# Altium schematic sheet Sheet1.SchDoc
size A1
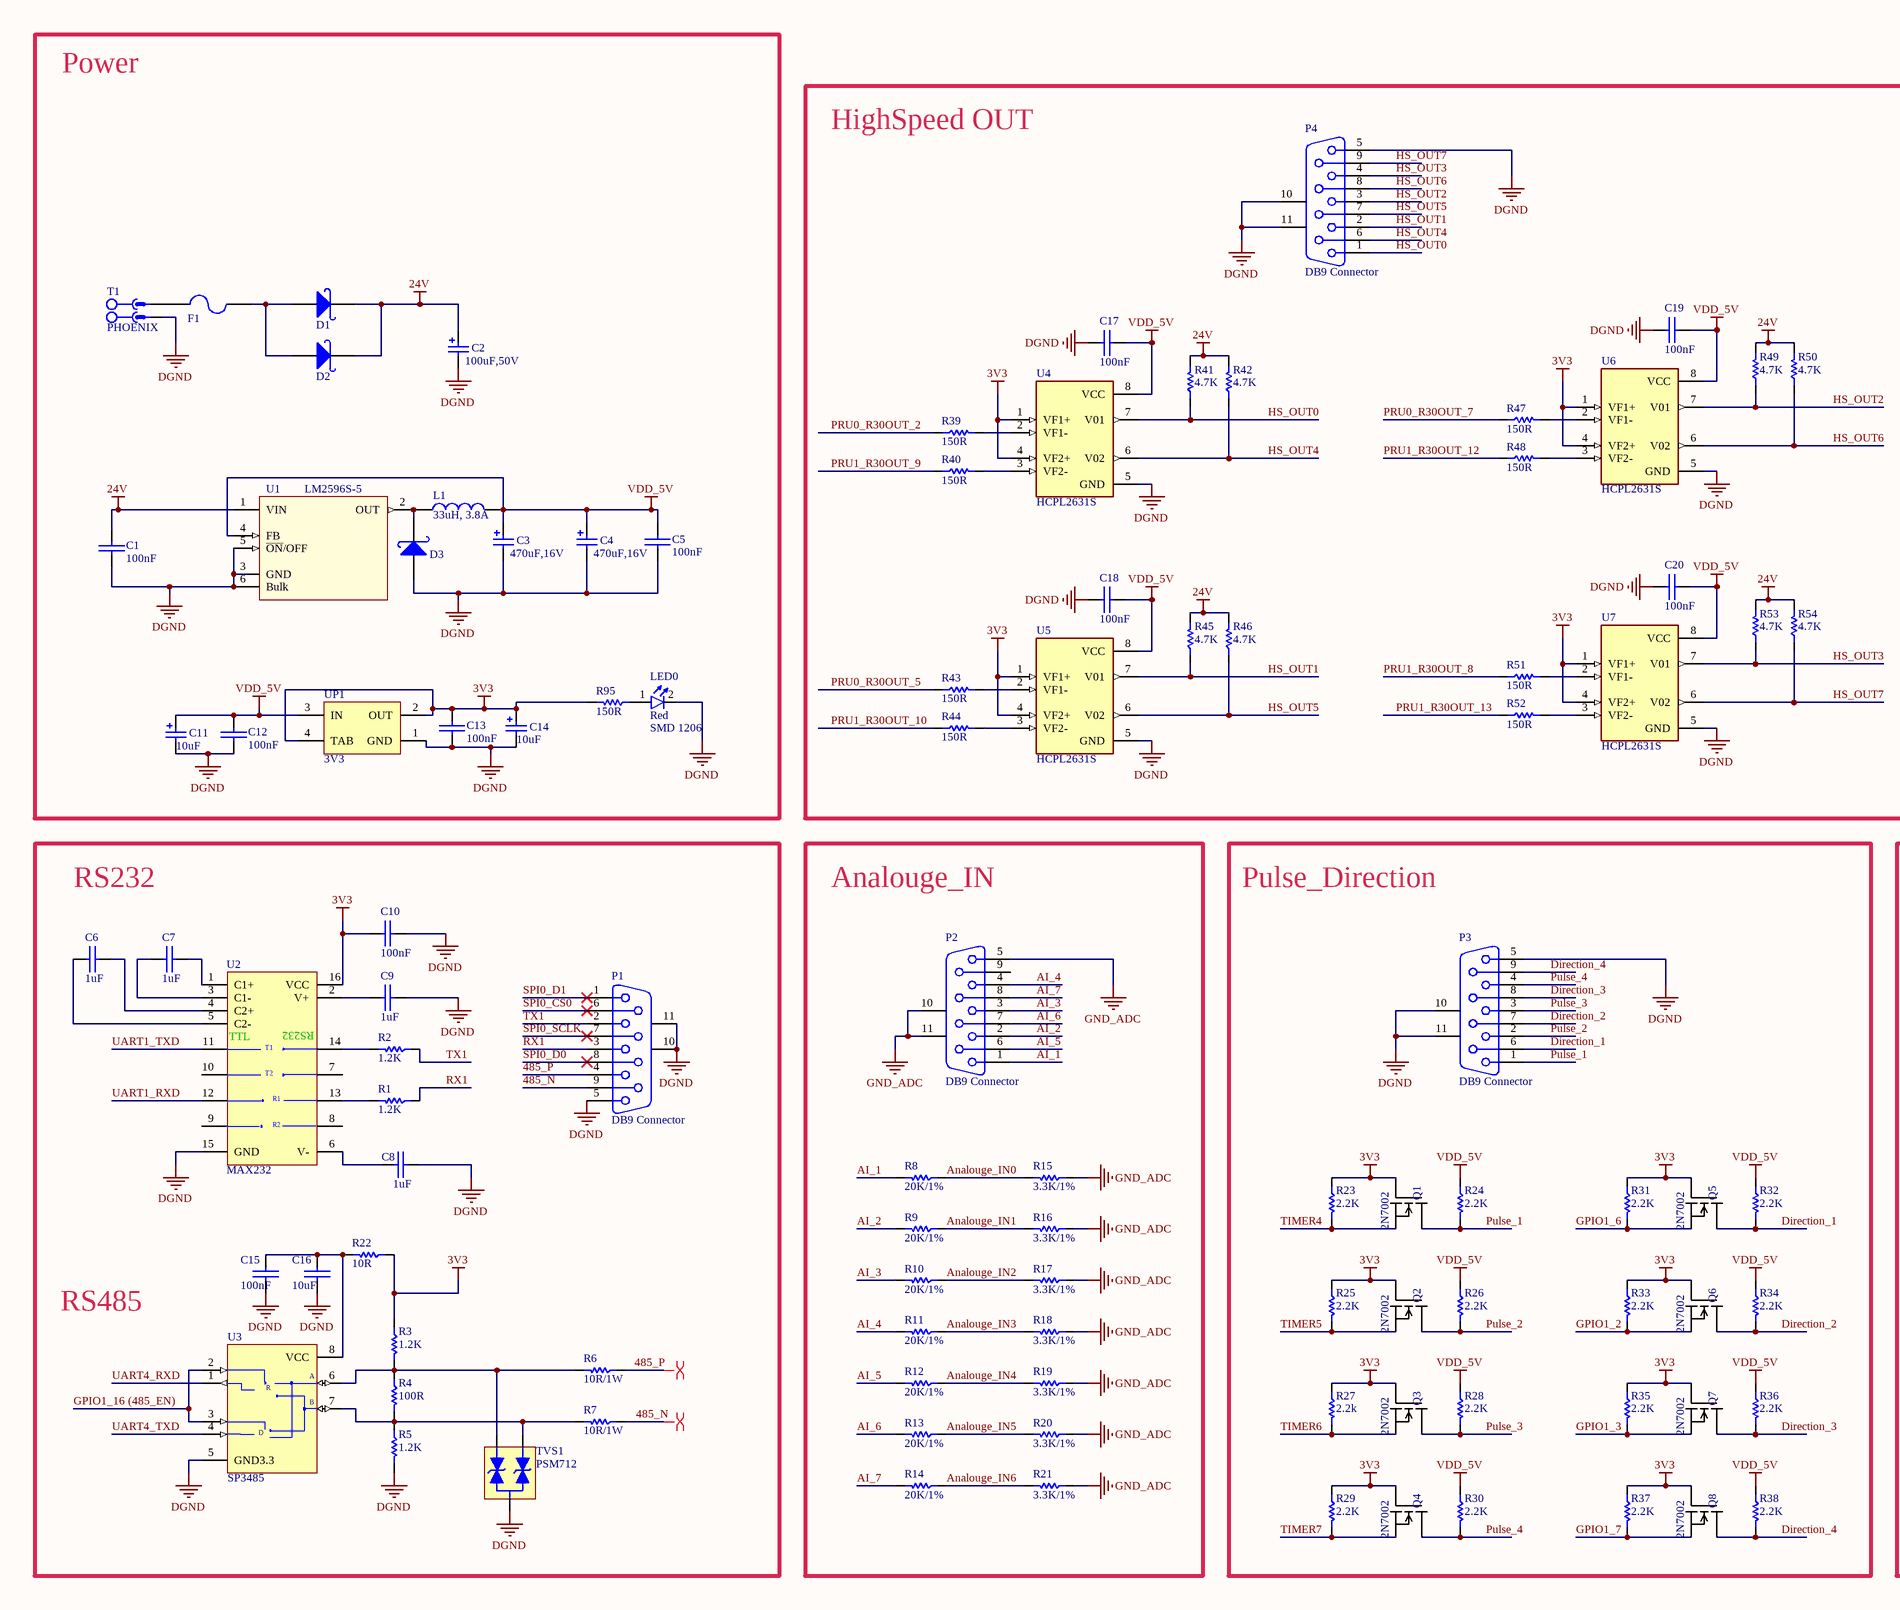
[diagram p0: Sheet1.SchDoc, left]
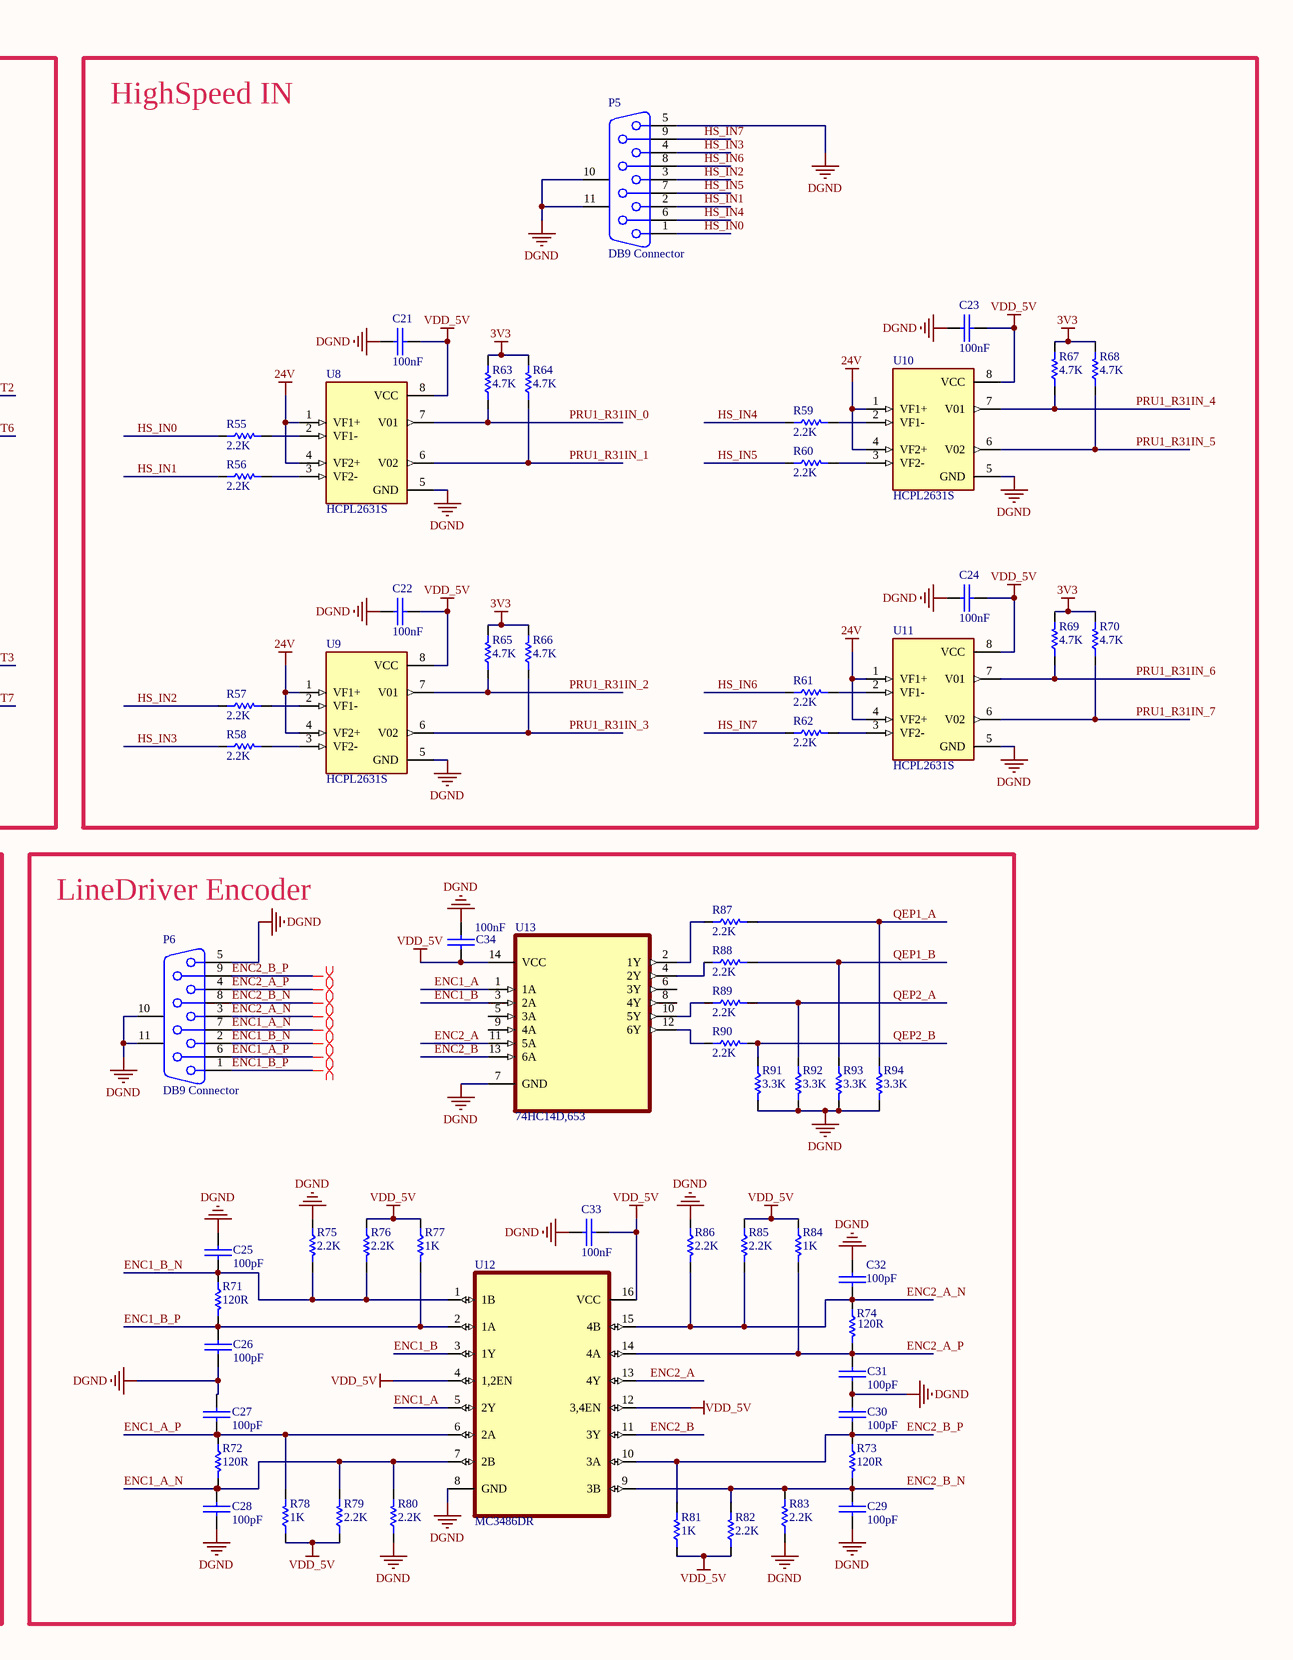
[diagram p1: Sheet1.SchDoc, right]

## Parts
C1  100nF  [SMD_CAP_0805]
C2  100uF,50V  [WCAP-AS5H_8x10.5]
C3  470uF,16V  [WCAP-AS5H_8x10.5]
C4  470uF,16V  [WCAP-AS5H_8x10.5]
C5  100nF  [SMD_CAP_0805]
C6  1uF  [SMD_CAP_0805]
C7  1uF  [SMD_CAP_0805]
C8  1uF  [SMD_CAP_0805]
C9  1uF  [SMD_CAP_0805]
C10  100nF  [SMD_CAP_0805]
C11  10uF  [WCAP-AS5H_4x5.5]
C12  100nF  [SMD_CAP_0805]
C13  100nF  [SMD_CAP_0805]
C14  10uF  [WCAP-AS5H_4x5.5]
C15  100nF  [SMD_CAP_0805]
C16  10uF  [SMD_CAP_0805]
C17  100nF  [SMD_CAP_0805]
C18  100nF  [SMD_CAP_0805]
C19  100nF  [SMD_CAP_0805]
C20  100nF  [SMD_CAP_0805]
C21  100nF  [SMD_CAP_0805]
C22  100nF  [SMD_CAP_0805]
C23  100nF  [SMD_CAP_0805]
C24  100nF  [SMD_CAP_0805]
C25  100pF  [SMD_CAP_0805]
C26  100pF  [SMD_CAP_0805]
C27  100pF  [SMD_CAP_0805]
C28  100pF  [SMD_CAP_0805]
C29  100pF  [SMD_CAP_0805]
C30  100pF  [SMD_CAP_0805]
C31  100pF  [SMD_CAP_0805]
C32  100pF  [SMD_CAP_0805]
C33  100nF  [SMD_CAP_0805]
C34  100nF  [SMD_CAP_0805]
D1  1n5822  [Diode 1N4007 SMD]  (value not drawn)
D2  1n5822  [Diode 1N4007 SMD]  (value not drawn)
D3  1n5822  [Diode 1N4007 SMD]  (value not drawn)
F1  F=1.0 A  [1206 FUSE]  (value not drawn)
L1  33uH, 3.8A  [WE-PD_1210]
LED0  Size: SMD 1206  [LED-3mm]  (hidden comment: Red)
P1  DB9 Connector  [DB9 Female]
P2  DB9 Connector  [DB9 Female]
P3  DB9 Connector  [DB9 Female]
P4  DB9 Connector  [DB9 Female]
P5  DB9 Connector  [DB9 Female]
P6  DB9 Connector  [DB9 Female]
Q1  2N7002  [*SOT23]
Q2  2N7002  [*SOT23]
Q3  2N7002  [*SOT23]
Q4  2N7002  [*SOT23]
Q5  2N7002  [*SOT23]
Q6  2N7002  [*SOT23]
Q7  2N7002  [*SOT23]
Q8  2N7002  [*SOT23]
R1  1.2K  [RES 0805 (2012X06L)]
R2  1.2K  [RES 0805 (2012X06L)]
R3  1.2K  [RES 0805 (2012X06L)]
R4  100R  [RES 1206 (3216X08L)]
R5  1.2K  [RES 0805 (2012X06L)]
R6  10R/1W  [RES 1206 (3216X08L)]
R7  10R/1W  [RES 1206 (3216X08L)]
R8  20K/1%  [RES 0805 (2012X06L)]
R9  20K/1%  [RES 0805 (2012X06L)]
R10  20K/1%  [RES 0805 (2012X06L)]
R11  20K/1%  [RES 0805 (2012X06L)]
R12  20K/1%  [RES 0805 (2012X06L)]
R13  20K/1%  [RES 0805 (2012X06L)]
R14  20K/1%  [RES 0805 (2012X06L)]
R15  3.3K/1%  [RES 0805 (2012X06L)]
R16  3.3K/1%  [RES 0805 (2012X06L)]
R17  3.3K/1%  [RES 0805 (2012X06L)]
R18  3.3K/1%  [RES 0805 (2012X06L)]
R19  3.3K/1%  [RES 0805 (2012X06L)]
R20  3.3K/1%  [RES 0805 (2012X06L)]
R21  3.3K/1%  [RES 0805 (2012X06L)]
R22  10R  [RES 0805 (2012X06L)]
R23  2.2K  [RES 0805 (2012X06L)]
R24  2.2K  [RES 0805 (2012X06L)]
R25  2.2K  [RES 0805 (2012X06L)]
R26  2.2K  [RES 0805 (2012X06L)]
R27  2.2k  [RES 0805 (2012X06L)]
R28  2.2K  [RES 0805 (2012X06L)]
R29  2.2K  [RES 0805 (2012X06L)]
R30  2.2K  [RES 0805 (2012X06L)]
R31  2.2K  [RES 0805 (2012X06L)]
R32  2.2K  [RES 0805 (2012X06L)]
R33  2.2K  [RES 0805 (2012X06L)]
R34  2.2K  [RES 0805 (2012X06L)]
R35  2.2K  [RES 0805 (2012X06L)]
R36  2.2K  [RES 0805 (2012X06L)]
R37  2.2K  [RES 0805 (2012X06L)]
R38  2.2K  [RES 0805 (2012X06L)]
R39  150R  [RES 0805 (2012X06L)]
R40  150R  [RES 0805 (2012X06L)]
R41  4.7K  [RES 0805 (2012X06L)]
R42  4.7K  [RES 0805 (2012X06L)]
R43  150R  [RES 0805 (2012X06L)]
R44  150R  [RES 0805 (2012X06L)]
R45  4.7K  [RES 0805 (2012X06L)]
R46  4.7K  [RES 0805 (2012X06L)]
R47  150R  [RES 0805 (2012X06L)]
R48  150R  [RES 0805 (2012X06L)]
R49  4.7K  [RES 0805 (2012X06L)]
R50  4.7K  [RES 0805 (2012X06L)]
R51  150R  [RES 0805 (2012X06L)]
R52  150R  [RES 0805 (2012X06L)]
R53  4.7K  [RES 0805 (2012X06L)]
R54  4.7K  [RES 0805 (2012X06L)]
R55  2.2K  [RES 0805 (2012X06L)]
R56  2.2K  [RES 0805 (2012X06L)]
R57  2.2K  [RES 0805 (2012X06L)]
R58  2.2K  [RES 0805 (2012X06L)]
R59  2.2K  [RES 0805 (2012X06L)]
R60  2.2K  [RES 0805 (2012X06L)]
R61  2.2K  [RES 0805 (2012X06L)]
R62  2.2K  [RES 0805 (2012X06L)]
R63  4.7K  [RES 0805 (2012X06L)]
R64  4.7K  [RES 0805 (2012X06L)]
R65  4.7K  [RES 0805 (2012X06L)]
R66  4.7K  [RES 0805 (2012X06L)]
R67  4.7K  [RES 0805 (2012X06L)]
R68  4.7K  [RES 0805 (2012X06L)]
R69  4.7K  [RES 0805 (2012X06L)]
R70  4.7K  [RES 0805 (2012X06L)]
R71  120R  [RES 0805 (2012X06L)]
R72  120R  [RES 0805 (2012X06L)]
R73  120R  [RES 0805 (2012X06L)]
R74  120R  [RES 0805 (2012X06L)]
R75  2.2K  [RES 0805 (2012X06L)]
R76  2.2K  [RES 0805 (2012X06L)]
R77  1K  [RES 0805 (2012X06L)]
R78  1K  [RES 0805 (2012X06L)]
R79  2.2K  [RES 0805 (2012X06L)]
R80  2.2K  [RES 0805 (2012X06L)]
R81  1K  [RES 0805 (2012X06L)]
R82  2.2K  [RES 0805 (2012X06L)]
R83  2.2K  [RES 0805 (2012X06L)]
R84  1K  [RES 0805 (2012X06L)]
R85  2.2K  [RES 0805 (2012X06L)]
R86  2.2K  [RES 0805 (2012X06L)]
R87  2.2K  [RES 0805 (2012X06L)]
R88  2.2K  [RES 0805 (2012X06L)]
R89  2.2K  [RES 0805 (2012X06L)]
R90  2.2K  [RES 0805 (2012X06L)]
R91  3.3K  [RES 0805 (2012X06L)]
R92  3.3K  [RES 0805 (2012X06L)]
R93  3.3K  [RES 0805 (2012X06L)]
R94  3.3K  [RES 0805 (2012X06L)]
R95  150R  [RES 0805 (2012X06L)]
T1  PHOENIX  [MSTB 2,5/2-G-5,08]
TVS1  PSM712  [SOT23_BEC_N]
U1  LM2596S-5  [*TO170P1435X465-6N]
U2  MAX232  [NSO16_M]
U3  SP3485  [*SO08]
U4  HCPL2631S  [OPTO_HCPL2631S]
U5  HCPL2631S  [OPTO_HCPL2631S]
U6  HCPL2631S  [OPTO_HCPL2631S]
U7  HCPL2631S  [OPTO_HCPL2631S]
U8  HCPL2631S  [OPTO_HCPL2631S]
U9  HCPL2631S  [OPTO_HCPL2631S]
U10  HCPL2631S  [OPTO_HCPL2631S]
U11  HCPL2631S  [OPTO_HCPL2631S]
U12  MC3486DR  [SOIC127P600X175-16N]
U13  74HC14D,653  [SOIC127P600X175-14N]
UP1  3V3  [SOT223]

## Blocks framed on the sheet
Power: C1-C5 C11-C14 D1-D3 F1 L1 LED0 R95 T1 U1 UP1
HighSpeed OUT: C17-C20 P4 R39-R54 U4-U7
HighSpeed IN: C21-C24 P5 R55-R70 U8-U11
Analouge_IN: P2 R8-R21
Pulse_Direction: P3 Q1-Q8 R23-R38
LineDriver Encoder: C25-C34 P6 R71-R94 U12 U13

## Nets
3V3: C10.2(-) C13.1(+) C14.2(P) Q1.1(G) Q2.1(G) Q3.1(G) Q4.1(G) Q5.1(G) Q6.1(G) Q7.1(G) Q8.1(G) R3.1 R22.1 R23.1 R25.1 R27.1 R29.1 R31.1 R33.1 R35.1 R37.1 R63.2 R64.2 R65.2 R66.2 R67.2 R68.2 R69.2 R70.2 R95.2 U2.16(VCC) U4.1(VF1+) U4.4(VF2+) U5.1(VF1+) U5.4(VF2+) U6.1(VF1+) U6.4(VF2+) U7.1(VF1+) U7.4(VF2+) UP1.2(OUT) UP1.4(TAB)
24V: C1.1(+) C2.2(P) D1.2(K) D2.2(K) R41.2 R42.2 R45.2 R46.2 R49.2 R50.2 R53.2 R54.2 U1.1(VIN) U8.1(VF1+) U8.4(VF2+) U9.1(VF1+) U9.4(VF2+) U10.1(VF1+) U10.4(VF2+) U11.1(VF1+) U11.4(VF2+)
DGND: C1.2(-) C2.1(N) C3.1(N) C4.1(N) C5.2(-) C8.2(-) C9.2(-) C10.1(+) C11.1(N) C12.2(-) C13.2(-) C14.1(N) C15.1(+) C16.1(+) C17.1(+) C18.1(+) C19.1(+) C20.1(+) C21.1(+) C22.1(+) C23.1(+) C24.1(+) C25.2(-) C26.1(+) C27.2(-) C28.1(+) C29.1(+) C30.2(-) C31.1(+) C32.2(-) C33.1(+) C34.1(+) D3.1(A) LED0.2(K) P1.5 P1.10(MH1) P1.11(MH2) P3.5 P3.10(MH1) P3.11(MH2) P4.5 P4.10(MH1) P4.11(MH2) P5.5 P5.10(MH1) P5.11(MH2) P6.5 P6.10(MH1) P6.11(MH2) R5.2 R75.1 R80.1 R83.1 R86.1 R91.2 R92.2 R93.2 R94.2 T1.1 TVS1.3(K) U1.3(GND) U1.5(~{ON}/OFF) U1.6(Bulk) U2.15(GND) U3.5(GND3.3) U4.5(GND) U5.5(GND) U6.5(GND) U7.5(GND) U8.5(GND) U9.5(GND) U10.5(GND) U11.5(GND) U12.8(GND) U13.7(GND) UP1.1(GND)
GND_ADC: P2.5 P2.10(MH1) P2.11(MH2) R15.1 R16.1 R17.1 R18.1 R19.1 R20.1 R21.1
VDD_5V: C3.2(P) C4.2(P) C5.1(+) C11.2(P) C12.1(+) C17.2(-) C18.2(-) C19.2(-) C20.2(-) C21.2(-) C22.2(-) C23.2(-) C24.2(-) C33.2(-) C34.2(-) L1.2 R24.1 R26.1 R28.1 R30.1 R32.1 R34.1 R36.1 R38.1 R76.1 R77.1 R78.1 R79.1 R81.1 R82.1 R84.1 R85.1 U1.4(FB) U4.8(VCC) U5.8(VCC) U6.8(VCC) U7.8(VCC) U8.8(VCC) U9.8(VCC) U10.8(VCC) U11.8(VCC) U12.4(1,2EN) U12.12(3,4EN) U12.16(VCC) U13.14(VCC) UP1.3(IN)
485_N: P1.9 R7.1
485_P: P1.4 R6.1
AI_1: P2.1 R8.2
AI_2: P2.2 R9.2
AI_3: P2.3 R10.2
AI_4: P2.4 R11.2
AI_5: P2.6 R12.2
AI_6: P2.7 R13.2
AI_7: P2.8 R14.2
Analouge_IN0: R8.1 R15.2
Analouge_IN1: R9.1 R16.2
Analouge_IN2: R10.1 R17.2
Analouge_IN3: R11.1 R18.2
Analouge_IN4: R12.1 R19.2
Analouge_IN5: R13.1 R20.2
Analouge_IN6: R14.1 R21.2
Direction_1: P3.6 Q5.3(D) R32.2
Direction_2: P3.7 Q6.3(D) R34.2
Direction_3: P3.8 Q7.3(D) R36.2
Direction_4: P3.9 Q8.3(D) R38.2
ENC1_A: U12.5(2Y) U13.1(1A)
ENC1_A_N: C28.2(-) P6.7 R72.2 R79.2 R80.2 U12.7(2B)
ENC1_A_P: C27.1(+) P6.6 R72.1 R78.2 U12.6(2A)
ENC1_B: U12.3(1Y) U13.3(2A)
ENC1_B_N: C25.1(+) P6.2 R71.1 R75.2 R76.2 U12.1(1B)
ENC1_B_P: C26.2(-) P6.1 R71.2 R77.2 U12.2(1A)
ENC2_A: U12.13(4Y) U13.11(5A)
ENC2_A_N: C32.1(+) P6.3 R74.1 R85.2 R86.2 U12.15(4B)
ENC2_A_P: C31.2(-) P6.4 R74.2 R84.2 U12.14(4A)
ENC2_B: U12.11(3Y) U13.13(6A)
ENC2_B_N: C29.2(-) P6.8 R73.2 R82.2 R83.2 U12.9(3B)
ENC2_B_P: C30.1(+) P6.9 R73.1 R81.2 U12.10(3A)
GPIO1_2: Q6.2(S) R33.2
GPIO1_3: Q7.2(S) R35.2
GPIO1_6: Q5.2(S) R31.2
GPIO1_7: Q8.2(S) R37.2
GPIO1_16 (485_EN): U3.2(~{RE}) U3.3(DE)
HS_IN0: P5.1 R55.1
HS_IN1: P5.2 R56.1
HS_IN2: P5.3 R57.1
HS_IN3: P5.4 R58.1
HS_IN4: P5.6 R59.1
HS_IN5: P5.7 R60.1
HS_IN6: P5.8 R61.1
HS_IN7: P5.9 R62.1
HS_OUT0: P4.1 R41.1 U4.7(V01)
HS_OUT1: P4.2 R45.1 U5.7(V01)
HS_OUT2: P4.3 R49.1 U6.7(V01)
HS_OUT3: P4.4 R53.1 U7.7(V01)
HS_OUT4: P4.6 R42.1 U4.6(V02)
HS_OUT5: P4.7 R46.1 U5.6(V02)
HS_OUT6: P4.8 R50.1 U6.6(V02)
HS_OUT7: P4.9 R54.1 U7.6(V02)
PRU0_R30OUT_2: R39.1
PRU0_R30OUT_5: R43.1
PRU0_R30OUT_7: R47.1
PRU1_R30OUT_8: R51.1
PRU1_R30OUT_9: R40.1
PRU1_R30OUT_10: R44.1
PRU1_R30OUT_12: R48.1
PRU1_R30OUT_13: R52.1
PRU1_R31IN_0: R63.1 U8.7(V01)
PRU1_R31IN_1: R64.1 U8.6(V02)
PRU1_R31IN_2: R65.1 U9.7(V01)
PRU1_R31IN_3: R66.1 U9.6(V02)
PRU1_R31IN_4: R67.1 U10.7(V01)
PRU1_R31IN_5: R68.1 U10.6(V02)
PRU1_R31IN_6: R69.1 U11.7(V01)
PRU1_R31IN_7: R70.1 U11.6(V02)
Pulse_1: P3.1 Q1.3(D) R24.2
Pulse_2: P3.2 Q2.3(D) R26.2
Pulse_3: P3.3 Q3.3(D) R28.2
Pulse_4: P3.4 Q4.3(D) R30.2
QEP1_A: R87.2 R94.1
QEP1_B: R88.2 R93.1
QEP2_A: R89.2 R92.1
QEP2_B: R90.2 R91.1
RX1: P1.3 R1.1
SPI0_CS0: P1.6
SPI0_D0: P1.8
SPI0_D1: P1.1
SPI0_SCLK: P1.7
TIMER4: Q1.2(S) R23.2
TIMER5: Q2.2(S) R25.2
TIMER6: Q3.2(S) R27.2
TIMER7: Q4.2(S) R29.2
TX1: P1.2 R2.1
UART1_RXD: U2.12(R1OUT)
UART1_TXD: U2.11(T1IN)
UART4_RXD: U3.1(RO)
UART4_TXD: U3.4(DI)
NetC6_1: C6.1(+) U2.5(C2-)
NetC6_2: C6.2(-) U2.4(C2+)
NetC7_1: C7.1(+) U2.3(C1-)
NetC7_2: C7.2(-) U2.1(C1+)
NetC8_1: C8.1(+) U2.6(V-)
NetC9_1: C9.1(+) U2.2(V+)
NetC15_2: C15.2(-) C16.2(-) R22.2 U3.8(VCC)
NetD1_1: D1.1(A) D2.1(A) F1.1
NetD3_2: D3.2(K) L1.1 U1.2(OUT)
NetF1_2: F1.2 T1.2
NetLED0_1: LED0.1(A) R95.1
NetR1_2: R1.2 U2.13(R1IN)
NetR2_2: R2.2 U2.14(T1OUT)
NetR3_2: R3.2 R4.1 R6.2 TVS1.2(A) U3.6(A)
NetR4_2: R4.2 R5.1 R7.2 TVS1.1(A) U3.7(B)
NetR39_2: R39.2 U4.2(VF1-)
NetR40_2: R40.2 U4.3(VF2-)
NetR43_2: R43.2 U5.2(VF1-)
NetR44_2: R44.2 U5.3(VF2-)
NetR47_2: R47.2 U6.2(VF1-)
NetR48_2: R48.2 U6.3(VF2-)
NetR51_2: R51.2 U7.2(VF1-)
NetR52_2: R52.2 U7.3(VF2-)
NetR55_2: R55.2 U8.2(VF1-)
NetR56_2: R56.2 U8.3(VF2-)
NetR57_2: R57.2 U9.2(VF1-)
NetR58_2: R58.2 U9.3(VF2-)
NetR59_2: R59.2 U10.2(VF1-)
NetR60_2: R60.2 U10.3(VF2-)
NetR61_2: R61.2 U11.2(VF1-)
NetR62_2: R62.2 U11.3(VF2-)
NetR87_1: R87.1 U13.2(1Y)
NetR88_1: R88.1 U13.4(2Y)
NetR89_1: R89.1 U13.10(5Y)
NetR90_1: R90.1 U13.12(6Y)

Not connected (* = marked no-connect by the designer): P2 9; U2 7(T2OUT) 8(R2IN) 9(R2OUT) 10(T2IN); U13 5(3A) 6(3Y) 8(4Y) 9(4A)

## Layout directives
differential pair: 485_N, 485_P, ENC1_A_N, ENC1_A_P, ENC1_B_N, ENC1_B_P, ENC2_A_N, ENC2_A_P, ENC2_B_N, ENC2_B_P

## Notes on the sheet
- RS232
- RS485
- (in symbol MAX232) TTL; RS232; T1; T2; R1; R2
- (in symbol MAX485CPA) R; D

## Library data of the parts
C1 C5-C10 C12 C13 C15-C34 = Cap-Bipolar: Bipolar Capacitor; Voltage: 100V; Designer: Saeid Jorablo; Organazation: ControTec; Adding Date: 1387/12/20
  C1 C5 C10 C12 C13 C15 C17-C24 C33 C34: Value: 100nF
  C6-C9: Value: 1uF
  C16: Value: 10uF
  C25-C32: Value: 100pF
C2-C4 = 865230653012: WCAP-AS5H SMT Aluminum Electrolytic Capacitors, D8mm x L10.5mm, 47uF, +/-20%, 50VDC; Dissipation Factor: 12%; Endurance: 5000h; Leakage Current: 23.5uA; Ripple Current max.: 95mA; Technical Reference: ASDE105470M050DVCTEE000; ComponentLink1Description: Manufacturer; ComponentLink1URL: http://www.we-online.de; ComponentLink2Description: Datasheet; ComponentLink2URL: https://katalog.we-online.com/pbs/datasheet/865230653012.pdf; Length: 10.5mm; Mounting Technology: SMT; Operating Temperature: -40 to +105degC; Packaging: Tape and Reel; Published Date: August 2019; Capacitance: 47uF; Diameter: 8mm; Part Number: 865230653012; Publisher: Wurth Elektronik; Capacitance Tolerance: +/-20%; Rated Voltage: 50VDC
C11 C14 = 865230140001: WCAP-AS5H SMT Aluminum Electrolytic Capacitors, D4mm x L5.5mm, 22uF, +/-20%, 6.3VDC; Dissipation Factor: 32%; Endurance: 5000h; Leakage Current: 3uA; Ripple Current max.: 22mA; Technical Reference: ASDB055220M6R3DVCTAE000; ComponentLink1Description: Manufacturer; ComponentLink1URL: http://www.we-online.de; ComponentLink2Description: Datasheet; ComponentLink2URL: https://katalog.we-online.com/pbs/datasheet/865230140001.pdf; Length: 5.5mm; Mounting Technology: SMT; Operating Temperature: -40 to +105degC; Packaging: Tape and Reel; Published Date: August 2019; Capacitance: 22uF; Diameter: 4mm; Part Number: 865230140001; Publisher: Wurth Elektronik; Capacitance Tolerance: +/-20%; Rated Voltage: 6.3VDC
D1-D3 = 1N5822 SMD: Schottky Rectifiers; Part. No: SS34; Manufacturer: ON Semiconductor/Fairchild; Designer: Abbas Basereh; Link: https://www.aliexpress.com/item/Free-shipping-100pcs-1n5822-sma-smd-do-214ac-Schottky-diode-ss34/32337482329.html?spm=2114.01010208.3.1.zLZDsP&ws_ab_test=searchweb0_0,searchweb201602_4_10065_10068_10084_10083_10080_10082_10081_10060_10061_10062_10056_10055_10054_10059_10099_10078_10079_427_10073_10103_10102_10096_10052_10050_10051,searchweb201603_4&btsid=6e50dc92-ac69-45bc-a19e-209af19ce602; Link: http://www.tme.eu/en/details/ss34/smd-schottky-diodes/vishay/ss34-e357t/; Link: http://www.digikey.com/product-detail/en/on-semiconductor-fairchild/SS34/SS34FSCT-ND/2094459; Data: 16-12-2016
F1 = Fuse SMD1206: SMD Fuses 1206; Designer: Abbas Basereh; Desc.: SMD Fuses 1206; Data: 16-12-2016
L1 = 7447709470: WE-PD SMT Power Inductor, size 1210, 47uH, 3.8A; DC Resistance max.: 60mOhm; Self Resonant Frequency: 6.5MHz; Saturation Current: 4.5A; ComponentLink1Description: Manufacturer; ComponentLink1URL: http://www.we-online.de; ComponentLink2Description: Datasheet; ComponentLink2URL: https://katalog.we-online.com/pbs/datasheet/7447709470.pdf; Part Number: 7447709470; Published Date: April 2019; Publisher: Wurth Elektronik; Rated Current: 3.8A; Size: 1210; Inductance: 47uH; Operating Temperature: -40 to +125degC; Mounting Technology: SMT; Packaging: Tape and Reel; Value: 33uH, 3.8A
LED0 = LED: Designer: Saeid Jorablo; Organazation: ControTec; Adding Date: 1387/12/22; Color: Red
P1-P6 = DB9 Connector: Receptacle Assembly, 9 Position, Right Angle; PackageDocument: O; Positions: 9; Published: 15-Jun-2001; LatestRevisionDate: 17-Jul-2002; LatestRevisionNote: Re-released for DXP Platform.; DatasheetDocument: 1-Sep-1999; PackageReference: 788750; Publisher: Altium Limited; Orientation: Right Angle; Gender: Receptacle
Q1-Q8 = 2N7002: Transistor NPN Mos 2N7002 SILICONIX miliampere=100 V=60 SOt23; MF: STMicroelectronics; Availability: Unavailable; SnapEDA_Link: https://www.snapeda.com/parts/2N7002/STMicroelectronics/view-part/?ref=snap; Price: None; Package: SOT-23-3 Vishay; MP: 2N7002; Value: *
R1-R95 = Resistor: Tolerance: 5%; Power: 1/8 W
  R1-R3 R5: Value: 1.2K
  R4: Value: 100R
  R6 R7: Value: 10R/1W
  R8-R14: Value: 20K/1%
  R15-R21: Value: 3.3K/1%
  R22: Value: 10R
  R23-R26 R28-R38 R55-R62 R75 R76 R79 R80 R82 R83 R85-R90: Value: 2.2K
  R27: Value: 2.2k
  R39 R40 R43 R44 R47 R48 R51 R52 R95: Value: 150R
  R41 R42 R45 R46 R49 R50 R53 R54 R63-R70: Value: 4.7K
  R71-R74: Value: 120R
  R77 R78 R81 R84: Value: 1K
  R91-R94: Value: 3.3K
T1 = CON_Phoenix_MSTB_02: 2 Pitch: 5.08 mm Color: green Contact surface: Tin Assembly; Manufacturer: PHOENIX CONTACT; Connector type: PCB Terminal Block; designer: ABBAS BASEREH; Max Current: 12 A; Positions: 2; Voltage: 320 V; Category: Connector; ComponentLink1Description: Header, Nominal current: 12 A Rated voltage (III/2): 320 V Number of positions: 2 Pitch: 5.08 mm Color: green Contact surface: Tin Assembly: Soldering  DESIGNER:ABBAS BASEREH; ComponentLink2Description: Reference; Mounting Technology: Through-Hole; Pin Count: 2; Revision 1: 2017-3-1; Status: Unreleased; PART.NO: PHOENIX
U1 = LM2596S-3.3: MF: Texas Instruments; SnapEDA_Link: https://www.snapeda.com/parts/LM2596S-3.3/Texas%20Instruments/view-part/?ref=snap; Availability: Unavailable; MP: LM2596S-5; Price: None; Package: TO-263-6 HTC Korea; Value: *
U2 = MAX232: +5V Powered, Multi-Channel RS-232 Driver/Receiver; ComponentAuthor: Saeid Jorablo; ComponentLink1Description: Datasheet; ComponentLink1URL: http://pdfserv.maxim-ic.com/en/ds/MAX220-MAX249.pdf
U3 = MAX485CPA: Low-Power, Slew-Rate-Limited RS-485/RS-422 Transceiver; Published: 16-Jan-2001; LatestRevisionDate: 06-Jun-2005; LatestRevisionNote: Stylized 3D Model Added.; DatasheetVersion: Feb-1996; PackageVersion: RevB, 21-0043; PackageReference: PA8; Publisher: Altium Limited; PackageDescription: DIP; 8 Leads; Row Spacing 7.62 mm; Pitch 2.54 mm; Code_JEDEC: MS-001-AB; ComponentLink1Description: Manufacturer Link; ComponentLink1URL: http://www.maxim-ic.com/; ComponentLink2Description: Datasheet; ComponentLink2URL: http://pdfserv.maxim-ic.com/en/ds/MAX1487-MAX491.pdf
U4-U11 = HCPL2631S: Optocoupler, Dual, Logic o/p; MF: ON Semiconductor; MP: HCPL-2631.S; Price: None; SnapEDA_Link: https://www.snapeda.com/parts/HCPL-2631.S/ON%20Semiconductor/view-part/1005859/?ref=snap; Availability: Unavailable; Value: *; Package: None
U13 = 74HC14D,653: Inverter IC 6 Channel Schmitt Trigger 14-SO; MF: Nexperia USA; Price: None; Value: *; Package: SOIC-14 Nexperia; SnapEDA_Link: https://www.snapeda.com/parts/74HC14D,653/Nexperia%20USA%20Inc./view-part/1900523/?ref=snap; DigiKey-Purchase-URL: https://snapeda.com/shop?store=DigiKey&id=1900523; Availability: Unavailable; MP: 74HC14D,653
UP1 = AMS1117-x.x: x.x Volt, 800mA Low-Dropout Linear Regulator, 4-pin SOT-223; Designer: Ali Hafizi; Data: 16-12-2016
U12 = MC3486DR: Package: None; Price: None; Value: *; MP: MC3486DR; Availability: Unavailable